# EAGLE design led_cube (EAGLE 8.0.1)
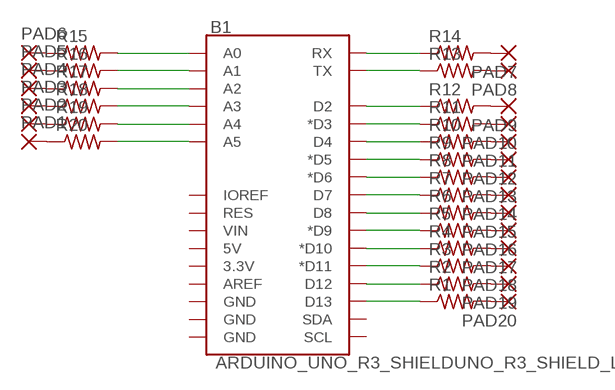
[diagram p0: schematic, sheet 1]

## Parts
B1  ARDUINO_UNO_R3_SHIELDUNO_R3_SHIELD_LOCK  [UNO_R3_SHIELD_LOCK]
PAD1  3,81/1,1  [3,81/1,1]
PAD2  3,81/1,1  [3,81/1,1]
PAD3  3,81/1,1  [3,81/1,1]
PAD4  3,81/1,1  [3,81/1,1]
PAD5  3,81/1,1  [3,81/1,1]
PAD6  3,81/1,1  [3,81/1,1]
PAD7  3,81/1,1  [3,81/1,1]
PAD8  3,81/1,1  [3,81/1,1]
PAD9  3,81/1,1  [3,81/1,1]
PAD10  3,81/1,1  [3,81/1,1]
PAD11  3,81/1,1  [3,81/1,1]
PAD12  3,81/1,1  [3,81/1,1]
PAD13  3,81/1,1  [3,81/1,1]
PAD14  3,81/1,1  [3,81/1,1]
PAD15  3,81/1,1  [3,81/1,1]
PAD16  3,81/1,1  [3,81/1,1]
PAD17  3,81/1,1  [3,81/1,1]
PAD18  3,81/1,1  [3,81/1,1]
PAD19  3,81/1,1  [3,81/1,1]
PAD20  3,81/1,1  [3,81/1,1]
R1  R-US_0204/7  [0204/7]
R2  R-US_0204/7  [0204/7]
R3  R-US_0204/7  [0204/7]
R4  R-US_0204/7  [0204/7]
R5  R-US_0204/7  [0204/7]
R6  R-US_0204/7  [0204/7]
R7  R-US_0204/7  [0204/7]
R8  R-US_0204/7  [0204/7]
R9  R-US_0204/7  [0204/7]
R10  R-US_0204/7  [0204/7]
R11  R-US_0204/7  [0204/7]
R12  R-US_0204/7  [0204/7]
R13  R-US_0204/7  [0204/7]
R14  R-US_0204/7  [0204/7]
R15  R-US_0204/7  [0204/7]
R16  R-US_0204/7  [0204/7]
R17  R-US_0204/7  [0204/7]
R18  R-US_0204/7  [0204/7]
R19  R-US_0204/7  [0204/7]
R20  R-US_0204/7  [0204/7]

## Nets
N$1: PAD1.1(P) R20.1
N$2: PAD2.1(P) R19.1
N$3: PAD3.1(P) R18.1
N$4: PAD4.1(P) R17.1
N$5: PAD5.1(P) R16.1
N$6: PAD6.1(P) R15.1
N$7: PAD7.1(P) R14.2
N$8: PAD8.1(P) R13.2
N$9: PAD9.1(P) R12.2
N$10: PAD10.1(P) R11.2
N$11: PAD11.1(P) R10.2
N$12: PAD12.1(P) R9.2
N$13: PAD13.1(P) R8.2
N$14: PAD14.1(P) R7.2
N$15: PAD15.1(P) R6.2
N$16: PAD16.1(P) R5.2
N$17: PAD17.1(P) R4.2
N$18: PAD18.1(P) R3.2
N$19: PAD19.1(P) R2.2
N$20: PAD20.1(P) R1.2
N$21: B1.A0 R15.2
N$22: B1.A1 R16.2
N$23: B1.A2 R17.2
N$24: B1.A3 R18.2
N$25: B1.A4 R19.2
N$26: B1.A5 R20.2
N$27: B1.RX R14.1
N$28: B1.TX R13.1
N$29: B1.D2 R12.1
N$30: B1.D3(*D3) R11.1
N$31: B1.D4 R10.1
N$32: B1.D5(*D5) R9.1
N$33: B1.D6(*D6) R8.1
N$34: B1.D7 R7.1
N$35: B1.D8 R6.1
N$36: B1.D9(*D9) R5.1
N$37: B1.D10(*D10) R4.1
N$38: B1.D11(*D11) R3.1
N$39: B1.D12 R2.1
N$40: B1.D13 R1.1
Unconnected: B1.3.3V B1.5V B1.AREF B1.GND@0(GND) B1.GND@1(GND) B1.GND@2(GND) B1.IOREF B1.RES B1.SCL B1.SDA B1.VIN

## Library data of the parts
B1 = SparkFun-Boards:ARDUINO_UNO_R3_SHIELD: Arduino R3 Shield Footprint Shield form compatible with the Arduino Uno R3. SparkFun Products: MG2639 Cellular Shield <https://www.sparkfun.com/products/13120> MIDI Shield <https://www.sparkfun.com/products/12898> R3 Stackable Headers Kit <https://www.sparkfun.com/products/11417>
PAD1-PAD20 = wirepad:3,81/1,1: THROUGH-HOLE PAD
R1-R20 = resistor:R-US_: RESISTOR, American symbol

## Board
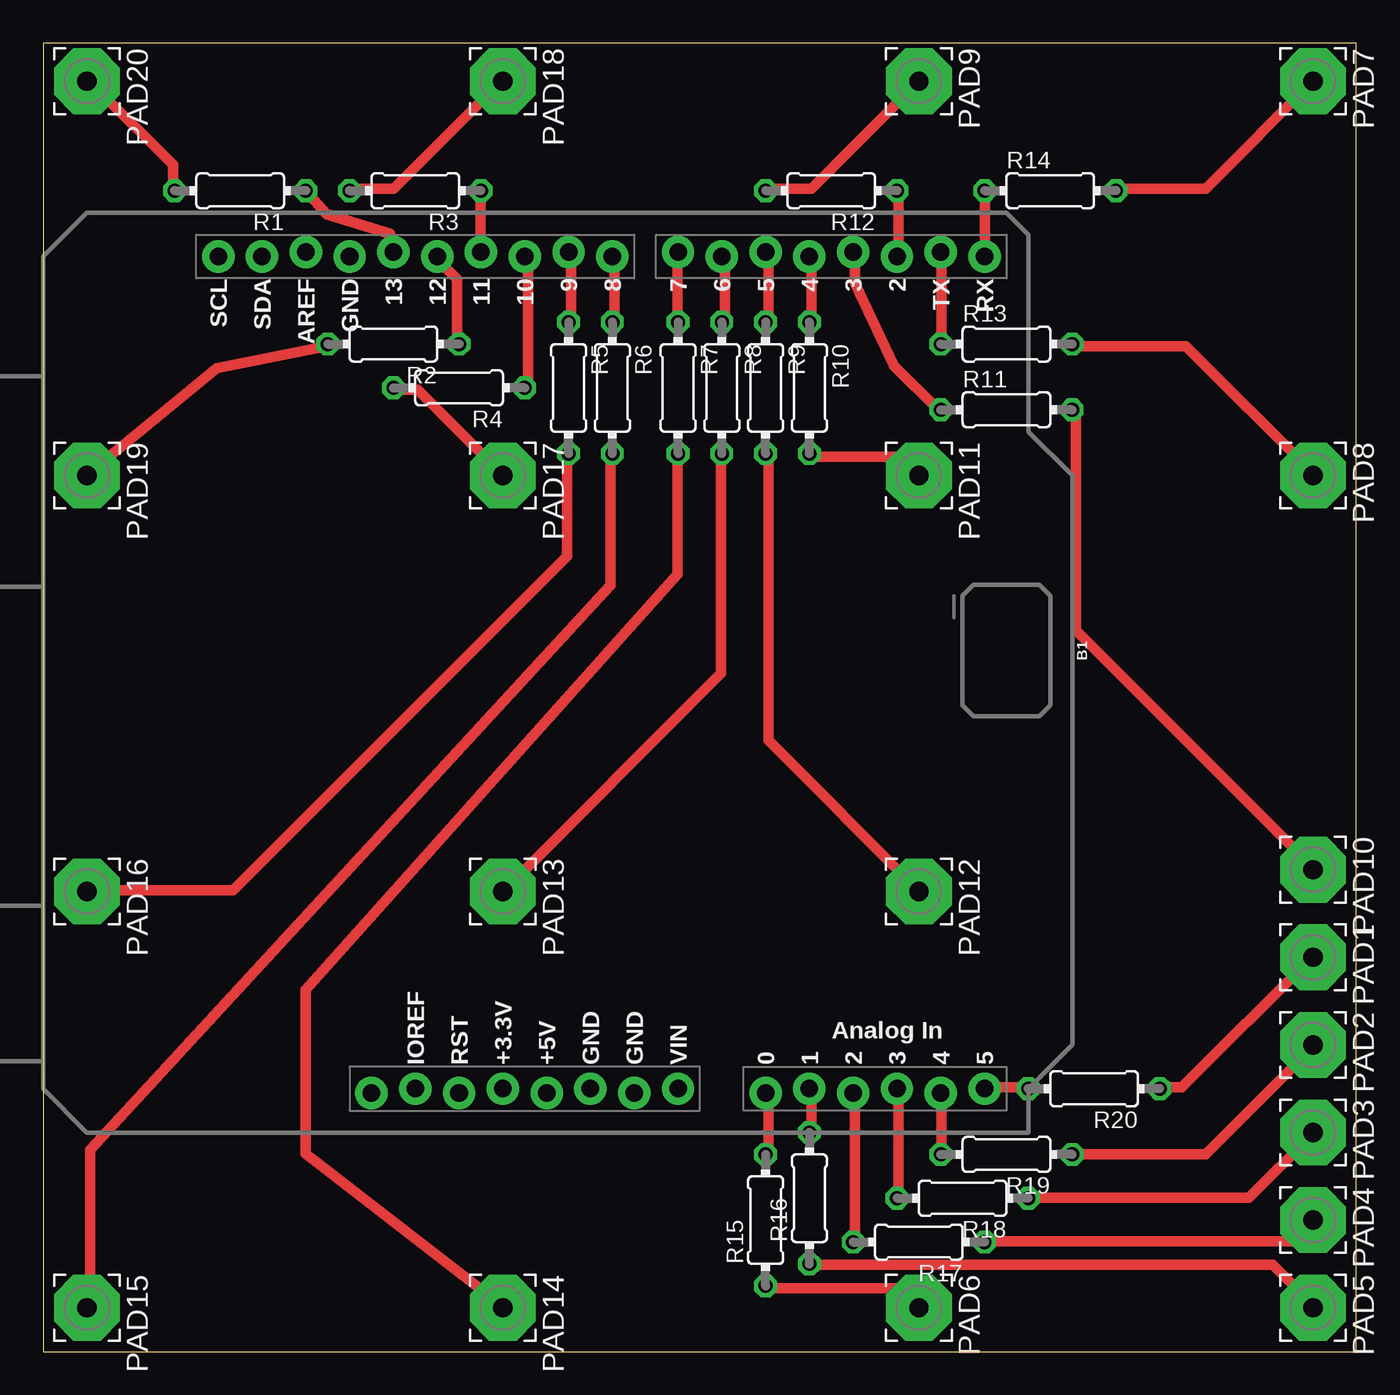
[diagram p1: board, top side]

Size 76.18 x 75.87 mm. Coordinates in mm from the lower left corner, seen from the top.
Outline: 0,0 76.18,0 76.18,75.87 0,75.87 0,0
Copper layers (1*16): Top 0.035mm / dielectric 1.5mm / Bottom 0.035mm
Design rules "default *": minimum track width 15mil, minimum drill 24mil, track to track 12mil, track to pad 12mil, pad to pad 12mil, via to via 12mil, smd to smd 12mil, copper to edge 40mil, drill to drill 8mil, minimum pad ring 10mil, minimum via ring 8mil, stop-mask expansion 4mil, vias tented up to drill 0mil, thermal gap 12mil

### Footprints (pad centres in the part's own frame; a part is rotated, then mirrored left to right if it is on the bottom)
UNO_R3_SHIELD_LOCK = drill 1.016 pad 1.88: 3.3V 24.13,-3.81; 5V 24.384,-1.27; A0 24.384,11.43; A1 24.13,13.97; A2 24.384,16.51; A3 24.13,19.05; A4 24.384,21.59; A5 24.13,24.13; AREF -24.384,-15.24; D2 -24.13,19.05; D3 -24.384,16.51; D4 -24.13,13.97; D5 -24.384,11.43; D6 -24.13,8.89; D7 -24.384,6.35; D8 -24.13,2.54; D9 -24.384,0; D10 -24.13,-2.54; D11 -24.384,-5.08; D12 -24.13,-7.62; D13 -24.384,-10.16; GND@0 24.13,1.27; GND@1 24.384,3.81; GND@2 -24.13,-12.7; IOREF 24.13,-8.89; NC 24.384,-11.43; RES 24.384,-6.35; RX -24.13,24.13; SCL -24.13,-20.32; SDA -24.13,-17.78; TX -24.384,21.59; VIN 24.13,6.35
3,81/1,1 = drill 1.118 pad 3.81 octagon: 1 0,0
0204/7 = drill 0.813 octagon: 1 -3.81,0; 2 3.81,0

### Placement (x,y rotation side)
B1  30.48,39.37 270 top
PAD1  73.66,22.86 270 top
PAD2  73.66,17.78 270 top
PAD3  73.66,12.7 270 top
PAD4  73.66,7.62 270 top
PAD5  73.66,2.54 270 top
PAD6  50.8,2.54 270 top
PAD7  73.66,73.66 270 top
PAD8  73.66,50.8 270 top
PAD9  50.8,73.66 270 top
PAD10  73.66,27.94 270 top
PAD11  50.8,50.8 270 top
PAD12  50.8,26.67 270 top
PAD13  26.67,26.67 270 top
PAD14  26.67,2.54 270 top
PAD15  2.54,2.54 270 top
PAD16  2.54,26.67 270 top
PAD17  26.67,50.8 270 top
PAD18  26.67,73.66 270 top
PAD19  2.54,50.8 270 top
PAD20  2.54,73.66 270 top
R1  11.43,67.31 180 top
R2  20.32,58.42 180 top
R3  21.59,67.31 180 top
R4  24.13,55.88 180 top
R5  30.48,55.88 270 top
R6  33.02,55.88 270 top
R7  36.83,55.88 270 top
R8  39.37,55.88 270 top
R9  41.91,55.88 270 top
R10  44.45,55.88 270 top
R11  55.88,54.61 0 top
R12  45.72,67.31 180 top
R13  55.88,58.42 0 top
R14  58.42,67.31 0 top
R15  41.91,7.62 90 top
R16  44.45,8.89 90 top
R17  50.8,6.35 180 top
R18  53.34,8.89 180 top
R19  55.88,11.43 180 top
R20  60.96,15.24 180 top

### Tracks (layer width: path | path; a pad name or v marks a point on that pad's centre or on a via)
N$1
  Top 0.254: 64.92,15.32 R20.1 | 73.61,22.86 PAD1.1
  Top 0.61: 64.92,15.32 66.06,15.32 73.61,22.86
N$2
  Top 0.254: 73.61,17.6 PAD2.1
  Top 0.61: R19.1 67.44,11.43 73.61,17.6
N$3
  Top 0.254: 57.15,8.91 R18.1 | 73.61,12.57 PAD3.1
  Top 0.61: 57.15,8.91 69.95,8.91 73.61,12.57
N$4
  Top 0.254: 54.63,6.4 R17.1 | 73.61,7.54 PAD4.1
  Top 0.61: 54.63,6.4 72.47,6.4 73.61,7.54
N$5
  Top 0.254: 44.58,5.03 R16.1 | 73.61,2.74 PAD5.1
  Top 0.61: 44.58,5.03 71.32,5.03 73.61,2.74
N$6
  Top 0.254: 42.06,3.66 R15.1 | 50.75,2.74 PAD6.1
  Top 0.61: 42.06,3.66 49.84,3.66 50.75,2.74
N$7
  Top 0.254: 62.41,67.44 R14.2
  Top 0.61: 62.41,67.44 67.44,67.44 PAD7.1
N$8
  Top 0.254: 59.89,58.29 R13.2 | 73.61,50.98 PAD8.1
  Top 0.61: 59.89,58.29 66.29,58.29 73.61,50.98
N$9
  Top 0.61: PAD9.1 44.58,67.44 42.06,67.44 R12.2
N$10
  Top 0.254: 59.89,54.41 R11.2 | 73.61,28.12 PAD10.1
  Top 0.61: 59.89,54.41 59.89,41.83 73.61,28.12
N$11
  Top 0.254: 50.75,50.98 PAD11.1
  Top 0.61: 50.75,50.98 49.84,51.89 44.58,51.89 R10.2
N$12
  Top 0.254: 50.75,26.75 PAD12.1
  Top 0.61: 50.75,26.75 42.06,35.43 42.06,51.89 R9.2
N$13
  Top 0.61: PAD13.1 39.32,39.32 39.32,51.89 R8.2
N$14
  Top 0.254: 26.52,2.74 PAD14.1
  Top 0.61: 26.52,2.74 15.24,11.48 15.24,20.98 36.8,45.09 36.8,51.89 R7.2
N$15
  Top 0.254: 2.74,2.74 PAD15.1
  Top 0.61: 2.74,2.74 2.74,11.71 32.92,44.42 32.92,51.89 R6.2
N$16
  Top 0.254: 2.74,26.75 PAD16.1
  Top 0.61: 2.74,26.75 11.02,26.75 30.4,46.13 30.4,51.89 R5.2
N$17
  Top 0.254: 26.52,50.98 PAD17.1
  Top 0.61: 26.52,50.98 21.72,55.78 20.34,55.78 R4.2
N$18
  Top 0.254: 26.52,73.61 PAD18.1
  Top 0.61: 26.52,73.61 20.34,67.44 17.83,67.44 R3.2
N$19
  Top 0.254: 2.74,50.98 PAD19.1
  Top 0.61: 2.74,50.98 10.06,57.02 16.46,58.29 R2.2
N$20
  Top 0.254: 7.54,67.44 R1.2 | 2.74,73.61 PAD20.1
  Top 0.61: 7.54,67.44 7.54,68.81 2.74,73.61
N$21
  Top 0.254: 42.06,11.43 R15.2 | 42.06,14.86 B1.A0
  Top 0.61: 42.06,14.86 42.06,11.43
N$22
  Top 0.254: 44.58,12.8 R16.2 | 44.58,15.09 B1.A1
  Top 0.61: 44.58,15.09 44.58,12.8
N$23
  Top 0.254: 47.09,6.4 R17.2 | 47.09,14.86 B1.A2
  Top 0.61: 47.09,14.86 47.09,6.4
N$24
  Top 0.254: 49.61,8.91 R18.2 | 49.61,15.09 B1.A3
  Top 0.61: 49.61,15.09 49.61,8.91
N$25
  Top 0.254: 52.12,11.43 R19.2 | 52.12,14.86 B1.A4
  Top 0.61: 52.12,14.86 52.12,11.43
N$26
  Top 0.254: 57.15,15.32 R20.2 | 54.63,15.32 B1.A5
  Top 0.61: 54.63,15.32 57.15,15.32
N$27
  Top 0.254: 54.63,67.21 R14.1 | 54.63,63.55 B1.RX
  Top 0.61: 54.63,63.55 54.63,67.21
N$28
  Top 0.254: 52.12,58.52 R13.1
  Top 0.61: 52.12,58.52 52.12,63.55 B1.TX
N$29
  Top 0.61: R12.1 49.61,67.21 49.61,63.55 B1.D2
N$30
  Top 0.254: 51.89,54.63 R11.1
  Top 0.61: 51.89,54.63 49.35,57.15 47.09,61.95 47.09,63.55 B1.D3
N$31
  Top 0.61: R10.1 44.58,59.89 44.58,63.32 B1.D4
N$32
  Top 0.61: R9.1 42.06,59.89 42.06,63.55 B1.D5
N$33
  Top 0.61: R8.1 39.55,59.89 39.55,63.32 B1.D6
N$34
  Top 0.61: R7.1 36.8,59.89 36.8,63.55 B1.D7
N$35
  Top 0.61: R6.1 33.15,59.89 33.15,63.32 B1.D8
N$36
  Top 0.61: R5.1 30.63,59.89 30.63,63.55 B1.D9
N$37
  Top 0.61: R4.1 28.12,56.01 28.12,63.32 B1.D10
N$38
  Top 0.254: 25.38,63.78 B1.D11
  Top 0.61: 25.38,63.78 25.38,67.21 R3.1
N$39
  Top 0.61: R2.1 24,58.52 24,62.18 22.86,63.32 B1.D12
N$40
  Top 0.61: R1.1 15.32,67.21 16.46,65.94 20.12,64.82 B1.D13